# EAGLE schematic beacon_1551G (EAGLE 6.1)
BLE112 Breakout Board v2.0 Full breakout board for all BLE112 functions, with optional LEDs, programming header, USB access, etc.
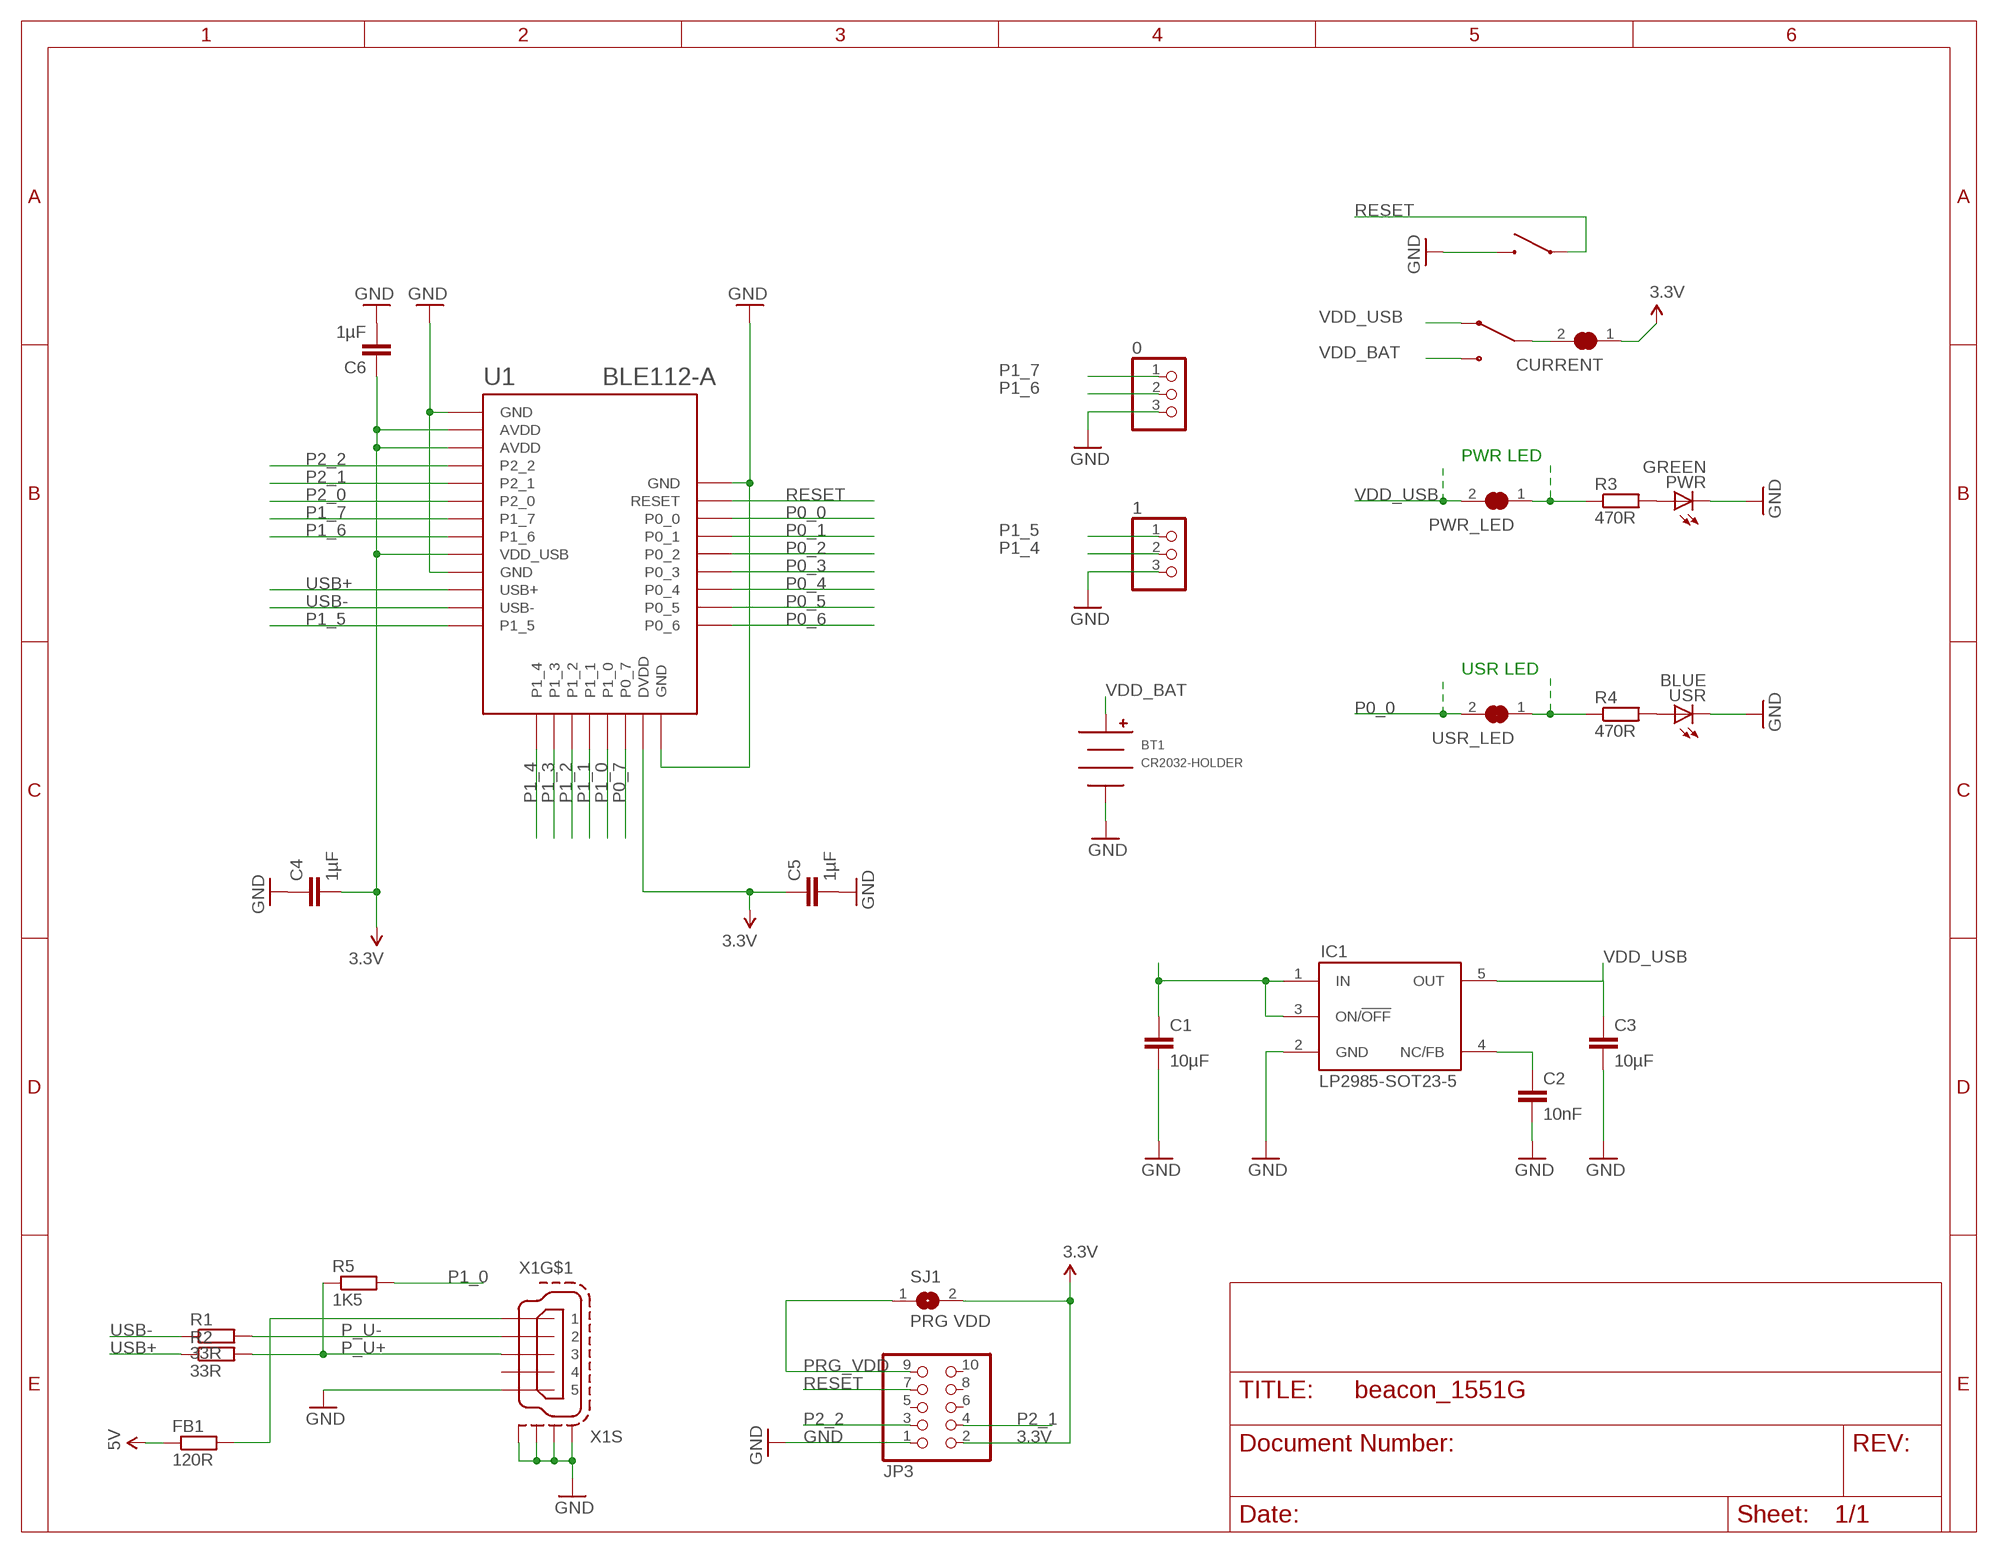
[diagram p0: schematic, sheet 1]

## Parts
0  HEADER-1X3ROUND  [1X03_ROUND]
1  HEADER-1X3ROUND  [1X03_ROUND]
BT1  CR2032-HOLDER  [CH28-2032LF]
C1  10µF  C-EUC0603  [C0603]
C2  10nF  C-EUC0603  [C0603]
C3  10µF  C-EUC0603  [C0603]
C4  1µF  C-EUC0603  [C0603]
C5  1µF  C-EUC0603  [C0603]
C6  1µF  C-EUC0603  [C0603]
CURRENT  SOLDERJUMPER_CLOSED  [SOLDERJUMPER_CLOSEDWIRE]
FB1  120R  R-EU_R0603  [R0603]
IC1  LP2985-SOT23-5  [SOT23-5]
JP3  ARM-JTAG_1.27-SMD  [20021121-10010XXLF]
PWR  GREEN  LEDCHIPLED_0805  [CHIPLED_0805]
PWR_LED  SOLDERJUMPER_CLOSED  [SOLDERJUMPER_CLOSEDWIRE]
R1  33R  R-EU_R0603  [R0603]
R2  33R  R-EU_R0603  [R0603]
R3  470R  R-EU_R0603  [R0603]
R4  470R  R-EU_R0603  [R0603]
R5  1K5  R-EU_R0603  [R0603]
RST  TACT-SWITCH-40-40  [40-40]
SJ1  PRG VDD  SJ  [SJ]
U1  BLE112-A  BLE112-A-VISUAL  [BLE112-A]
U$1  1P2T  [1P2T-ON-ON]
USR  BLUE  LEDCHIPLED_0805  [CHIPLED_0805]
USR_LED  SOLDERJUMPER_CLOSED  [SOLDERJUMPER_CLOSEDWIRE]
X1  MINI-USB-SCHIELD-32005-301  [32005-301]

## Nets
3.3V [power]: C4.2 C5.1 C6.1 CURRENT.1 JP3.2 SJ1.2 U1.AVDD1(AVDD) U1.AVDD2(AVDD) U1.DVDD U1.VDD_USB
5V [power]: FB1.1
GND [power]: 0.3 1.3 BT1.NEG C1.2 C2.2 C3.2 C4.1 C5.2 C6.2 IC1.2(GND) JP3.1 PWR.C RST.1 RST.2 U1.GND1(GND) U1.GND2(GND) U1.GND3(GND) U1.GND4(GND) USR.C X1.5 X1.M1(S:S1) X1.M2(S:S2) X1.M3(S:S3) X1.M4(S:S4)
N$1: PWR.A R3.2
N$2: R4.2 USR.A
N$3 [power]: PWR_LED.1 R3.1
N$4: CURRENT.2 U$1.2
N$5: R4.1 USR_LED.1
N$6 [power]: C1.1 IC1.1(IN) IC1.3(ON/!OFF)
N$11: C2.1 IC1.4(NC/FB)
P0_0: U1.P0_0 USR_LED.2
P0_1: U1.P0_1
P0_2: U1.P0_2
P0_3: U1.P0_3
P0_4: U1.P0_4
P0_5: U1.P0_5
P0_6: U1.P0_6
P0_7: U1.P0_7
P1_0: R5.2 U1.P1_0
P1_1: U1.P1_1
P1_2: U1.P1_2
P1_3: U1.P1_3
P1_4: 1.2 U1.P1_4
P1_5: 1.1 U1.P1_5
P1_6: 0.2 U1.P1_6
P1_7: 0.1 U1.P1_7
P2_0: U1.P2_0
P2_1: JP3.4 U1.P2_1
P2_2: JP3.3 U1.P2_2
P_U+: R2.2 R5.1 X1.3
P_U-: R1.2 X1.2
PRG_VDD [power]: JP3.9 SJ1.1
RESET: JP3.7 RST.3 RST.4 U1.RESET
USB+: R2.1 U1.USB+
USB-: R1.1 U1.USB-
VBUS [power]: FB1.2 X1.1
VDD_BAT: BT1.POS U$1.3
VDD_USB: C3.1 IC1.5(OUT) PWR_LED.2 U$1.1
Unconnected: JP3.5 JP3.6 JP3.8 JP3.10 X1.4

## Notes on the sheet
- PWR LED
- USR LED

## Library data of the parts
0 1 = microbuilder:HEADER-1X3: PIN HEADER
BT1 = battery-holder:CR2032-HOLDER
C1-C6 = rcl:C-EU: CAPACITOR, European symbol
CURRENT PWR_LED USR_LED = microbuilder:SOLDERJUMPER_CLOSED: Solder Jumper - Closed These solder jumpers are closed by default CLOSEDWIRE - 10 mil trace between pads that can be cut and resoldered later CLOSEDPERM - 63 mil trace between pads for a permanent connection (used to 'bridge' two signals, a shameless hack for Eagle). Can double as a test point as well (no cream layer)
FB1 R1-R5 = rcl:R-EU_: RESISTOR, European symbol
IC1 = vreg:LP2985
JP3 = nxp:ARM-JTAG: PIN HEADER
PWR USR = led:LED: LED OSRAM: - CHIPLED LG R971, LG N971, LY N971, LG Q971, LY Q971, LO R971, LY R971 LH N974, LH R974 LS Q976, LO Q976, LY Q976 LO Q996 - Hyper CHIPLED LW Q18S LB Q993, LB Q99A, LB R99A - SideLED LS A670, LO A670, LY A670, LG A670, LP A670 LB A673, LV A673, LT A673, LW A673 LH A674 LY A675 LS A676, LA A676, LO A676, LY A676, LW A676 LS A679, LY A679, LG A679 - Hyper Micro SIDELED® LS Y876, LA Y876, LO Y876, LY Y876 LT Y87S - SmartLED LW L88C, LW L88S LB L89C, LB L89S, LG L890 LS L89K, LO L89K, LY L89K LS L896, LA L896, LO L896, LY L896 - TOPLED LS T670, LO T670, LY T670, LG T670, LP T670 LSG T670, LSP T670, LSY T670, LOP T670, LYG T670 LG T671, LOG T671, LSG T671 LB T673, LV T673, LT T673, LW T673 LH T674 LS T676, LA T676, LO T676, LY T676, LB T676, LH T676, LSB T676, LW T676 LB T67C, LV T67C, LT T67C, LS T67K, LO T67K, LY T67K, LW E67C LS E67B, LA E67B, LO E67B, LY E67B, LB E67C, LV E67C, LT E67C LW T67C LS T679, LY T679, LG T679 LS T770, LO T770, LY T770, LG T770, LP T770 LB T773, LV T773, LT T773, LW T773 LH T774 LS E675, LA E675, LY E675, LS T675 LS T776, LA T776, LO T776, LY T776, LB T776 LHGB T686 LT T68C, LB T68C - Hyper Mini TOPLED® LB M676 - Mini TOPLED Santana® LG M470 LS M47K, LO M47K, LY M47K Source: http://www.osram.convergy.de LUXEON: - LUMILED® LXK2-PW12-R00, LXK2-PW12-S00, LXK2-PW14-U00, LXK2-PW14-V00 LXK2-PM12-R00, LXK2-PM12-S00, LXK2-PM14-U00 LXK2-PE12-Q00, LXK2-PE12-R00, LXK2-PE12-S00, LXK2-PE14-T00, LXK2-PE14-U00 LXK2-PB12-K00, LXK2-PB12-L00, LXK2-PB12-M00, LXK2-PB14-N00, LXK2-PB14-P00, LXK2-PB14-Q00 LXK2-PR12-L00, LXK2-PR12-M00, LXK2-PR14-Q00, LXK2-PR14-R00 LXK2-PD12-Q00, LXK2-PD12-R00, LXK2-PD12-S00 LXK2-PH12-R00, LXK2-PH12-S00 LXK2-PL12-P00, LXK2-PL12-Q00, LXK2-PL12-R00 Source: www.luxeon.com KINGBRIGHT: KA-3528ASYC Source: www.kingbright.com
RST = tactile-switch:TACT-SWITCH-40-40
SJ1 = jumper:SJ: SMD solder JUMPER
U1 = sf-bluegiga:BLE112-A-VISUAL: Bluetooth Low Energy single-mode module - Bluetooth 4.0, chip antenna
U$1 = switch:1P2T
X1 = con-cypressindustries:MINI-USB-SCHIELD-: MINI USB-B Conector Source: www.cypressindustries.com; OC_FARNELL: unknown; OC_NEWARK: unknown

## Net classes
0 default: width 0.152 mm, drill 0.33 mm, clearance 0.152 mm
1 power: width 0.254 mm, drill 0.33 mm, clearance 0.152 mm